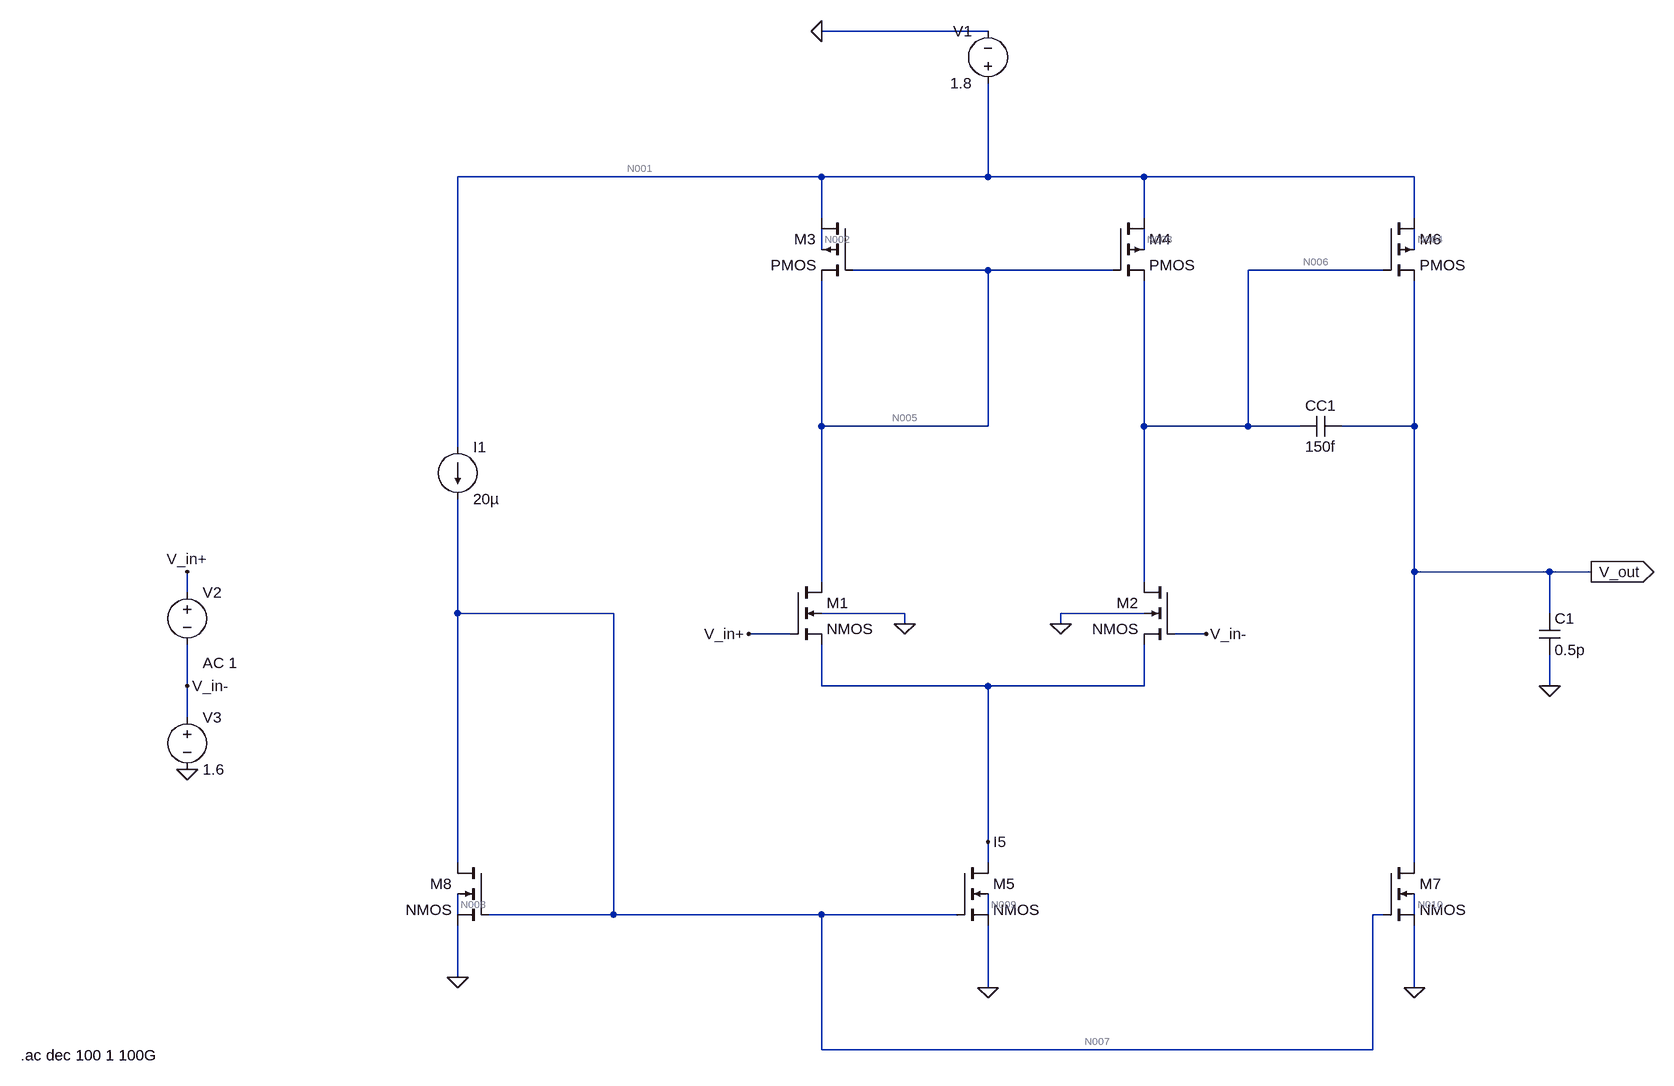
[diagram p0: schematic Final Bode plot.asc]
Final Bode plot.asc, the LTspice schematic file:
Version 4.1
SHEET 1 1280 872
WIRE 224 -720 -32 -720
WIRE -32 -496 -592 -496
WIRE 224 -496 224 -640
WIRE 224 -496 -32 -496
WIRE 464 -496 224 -496
WIRE 880 -496 464 -496
WIRE -32 -432 -32 -496
WIRE 464 -432 464 -496
WIRE 880 -432 880 -496
WIRE -32 -384 -32 -416
WIRE 464 -384 464 -416
WIRE 880 -384 880 -416
WIRE 224 -352 16 -352
WIRE 416 -352 224 -352
WIRE 832 -352 624 -352
WIRE -32 -112 -32 -336
WIRE 224 -112 224 -352
WIRE 224 -112 -32 -112
WIRE 464 -112 464 -336
WIRE 624 -112 624 -352
WIRE 624 -112 464 -112
WIRE 704 -112 624 -112
WIRE 880 -112 880 -336
WIRE 880 -112 768 -112
WIRE -592 -80 -592 -496
WIRE 880 112 880 -112
WIRE 1088 112 880 112
WIRE 1152 112 1088 112
WIRE -32 128 -32 -112
WIRE 464 128 464 -112
WIRE -1008 144 -1008 112
WIRE -592 176 -592 0
WIRE -352 176 -592 176
WIRE 96 176 -32 176
WIRE 464 176 336 176
WIRE 1088 176 1088 112
WIRE 96 192 96 176
WIRE 336 192 336 176
WIRE -80 208 -144 208
WIRE 560 208 512 208
WIRE -1008 288 -1008 224
WIRE -32 288 -32 224
WIRE 224 288 -32 288
WIRE 464 288 464 224
WIRE 464 288 224 288
WIRE 1088 288 1088 240
WIRE -1008 336 -1008 288
WIRE 224 528 224 288
WIRE -592 560 -592 176
WIRE 224 560 224 528
WIRE 880 560 880 112
WIRE -592 640 -592 608
WIRE -352 640 -352 176
WIRE -352 640 -544 640
WIRE -32 640 -352 640
WIRE 176 640 -32 640
WIRE 224 640 224 608
WIRE 832 640 816 640
WIRE 880 640 880 608
WIRE -592 736 -592 656
WIRE 224 752 224 656
WIRE 880 752 880 656
WIRE -32 848 -32 640
WIRE 816 848 816 640
WIRE 816 848 -32 848
FLAG 96 192 0
FLAG 336 192 0
FLAG 224 752 0
FLAG -592 736 0
FLAG 880 752 0
FLAG 224 528 I5
FLAG -32 -720 0
FLAG 1088 288 0
FLAG 1152 112 V_out
IOPIN 1152 112 Out
FLAG -1008 416 0
FLAG -1008 112 V_in+
FLAG -144 208 V_in+
FLAG -1008 288 V_in-
FLAG 560 208 V_in-
SYMBOL pmos4 416 -432 R0
SYMATTR InstName M4
SYMATTR Value2 l=1u w=7u
SYMBOL pmos4 16 -432 M0
SYMATTR InstName M3
SYMATTR Value2 l=1u w=7u
SYMBOL pmos4 832 -432 R0
SYMATTR InstName M6
SYMATTR Value2 l=1u w=87.5u
SYMBOL nmos4 -80 128 R0
SYMATTR InstName M1
SYMATTR Value2 l=1u w=25u
SYMBOL nmos4 176 560 R0
SYMATTR InstName M5
SYMATTR Value2 l=1u w=6u
SYMBOL nmos4 -544 560 M0
SYMATTR InstName M8
SYMATTR Value2 l=1u w=6u
SYMBOL nmos4 512 128 M0
SYMATTR InstName M2
SYMATTR Value2 l=1u w=25u
SYMBOL current -592 -80 R0
WINDOW 123 0 0 Left 0
WINDOW 39 0 0 Left 0
SYMATTR InstName I1
SYMATTR Value 20µ
SYMBOL nmos4 832 560 R0
SYMATTR InstName M7
SYMATTR Value2 l=1u w=37.5u
SYMBOL cap 768 -128 R90
WINDOW 0 0 32 VBottom 2
WINDOW 3 32 32 VTop 2
SYMATTR InstName CC1
SYMATTR Value 150f
SYMBOL voltage 224 -624 R180
WINDOW 0 24 96 Left 2
WINDOW 3 24 16 Left 2
WINDOW 123 0 0 Left 0
WINDOW 39 0 0 Left 0
SYMATTR InstName V1
SYMATTR Value 1.8
SYMBOL cap 1072 176 R0
SYMATTR InstName C1
SYMATTR Value 0.5p
SYMBOL voltage -1008 128 R0
WINDOW 123 24 124 Left 2
WINDOW 39 0 0 Left 0
SYMATTR Value2 AC 1
SYMATTR InstName V2
SYMATTR Value ""
SYMBOL voltage -1008 320 R0
WINDOW 123 24 124 Left 2
WINDOW 39 0 0 Left 0
SYMATTR InstName V3
SYMATTR Value 1.6
TEXT -1264 856 Left 2 !.ac dec 100 1 100G

The netlist it stands for:
* Final Bode plot.asc
M4 N001 N005 N006 N003 PMOS l=1u w=7u
M3 N001 N005 N005 N002 PMOS l=1u w=7u
M6 N001 N006 V_out N004 PMOS l=1u w=87.5u
M1 N005 V_in+ I5 0 NMOS l=1u w=25u
M5 I5 N007 0 N009 NMOS l=1u w=6u
M8 N007 N007 0 N008 NMOS l=1u w=6u
M2 N006 V_in- I5 0 NMOS l=1u w=25u
I1 N001 N007 20µ
M7 V_out N007 0 N010 NMOS l=1u w=37.5u
CC1 V_out N006 150f
V1 N001 0 1.8
C1 V_out 0 0.5p
V2 V_in+ V_in- AC 1
V3 V_in- 0 1.6
.model NMOS NMOS
.model PMOS PMOS
.lib standard.mos
.ac dec 100 1 100G
.backanno
.end

* Results of the author's LTspice run, read from the files saved beside the schematic
* Operating Point, zero values left out:
*   V(n005) = 1.422 V
*   V(n003) = 1.666 V
*   V(n002) = 1.666 V
*   V(n004) = 1.666 V
*   V(n007) = 577.4 mV
*   V(n008) = 90.18 mV
*   V(v_in-) = 1.6 V
*   V(n001) = 1.8 V
*   V(n006) = 1.422 V
*   V(v_out) = 1.422 V
*   V(v_in+) = 1.6 V
*   V(i5) = 1.332 V
*   V(n009) = 119 mV
*   V(n010) = 121.1 mV
*   Id(M4) = 10 µA
*   Is(M4) = -10 µA
*   Ib(M4) = -1.666 pA
*   Id(M6) = 125 µA
*   Is(M6) = -125 µA
*   Ib(M6) = -1.666 pA
*   Id(M5) = 20 µA
*   Is(M5) = -20 µA
*   I(I1) = 20 µA
*   I(V1) = -165 µA
*   Id(M8) = 20 µA
*   Is(M8) = -20 µA
*   Id(M1) = 10 µA
*   Is(M1) = -10 µA
*   Ib(M1) = -2.774 pA
*   Id(M7) = 125 µA
*   Is(M7) = -125 µA
*   Id(M3) = 10 µA
*   Is(M3) = -10 µA
*   Ib(M3) = -1.666 pA
*   Id(M2) = 10 µA
*   Is(M2) = -10 µA
*   Ib(M2) = -2.774 pA